# EAGLE design untitled (EAGLE 9.6.2)
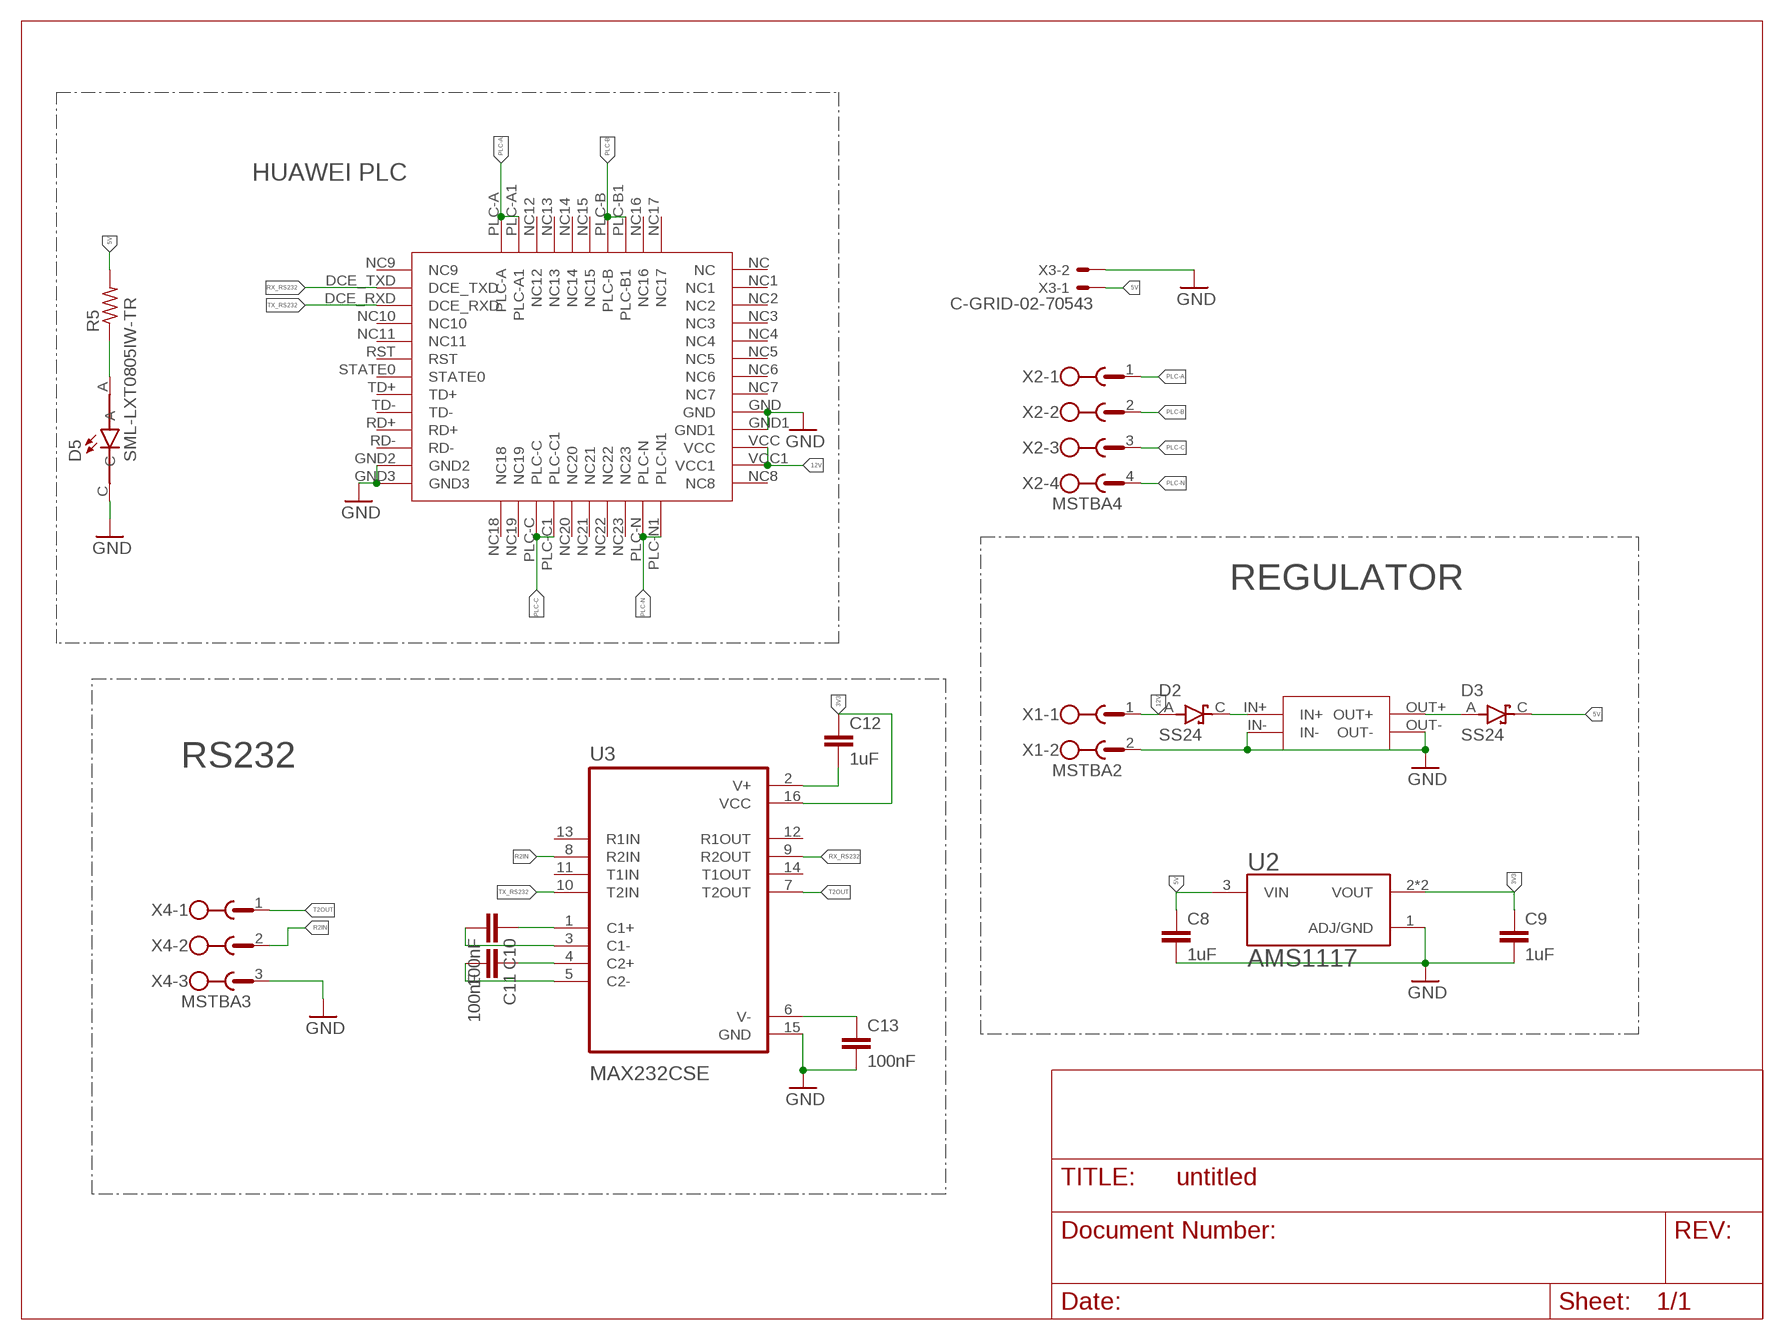
[diagram p0: schematic, sheet 1]

## Parts
C8  1uF  C-EUC0805K  [C0805K]
C9  1uF  C-EUC0805K  [C0805K]
C10  100nF  C-EUC0805K  [C0805K]
C11  100nF  C-EUC0805K  [C0805K]
C12  1uF  C-EUC0805K  [C0805K]
C13  100nF  C-EUC0805K  [C0805K]
D2  SS24  [DIOM5336X265N]
D3  SS24  [DIOM5336X265N]
D5  SML-LXT0805IW-TR  [LEDC2012X120N]
HUAWEI-PLC1  HUAWEI-PLC  [HUAWEI-PLC]
MINI1  MINI560  [MINI560]
R5  R-US_M0805  [M0805]
U2  AMS1117  [SOT229P700X180-4N]
U3  MAX232CSE  [SOIC127P600X175-16N]
X1  MSTBA2  [MSTBA2]
X2  MSTBA4  [MSTBA4]
X3  C-GRID-02-70543  [70543-02]
X4  MSTBA3  [MSTBA3]

## Nets
3V3: C9.1 C12.1 U2.2(VOUT) U2.4(VOUT) U3.16(VCC)
5V: C8.1 D3.C(K) R5.2 U2.3(VIN) X3.1
12V: D2.A HUAWEI-PLC1.VCC HUAWEI-PLC1.VCC1 X1.1
GND: C8.2 C9.2 C13.2 D5.C HUAWEI-PLC1.GND HUAWEI-PLC1.GND1 HUAWEI-PLC1.GND2 HUAWEI-PLC1.GND3 MINI1.IN- MINI1.OUT- U2.1(ADJ/GND) U3.15(GND) X1.2 X3.2 X4.3
N$7: D2.C(K) MINI1.IN+
N$9: D3.A MINI1.OUT+
N$11: C10.1 U3.1(C1+)
N$12: C10.2 U3.3(C1-)
N$13: C11.1 U3.4(C2+)
N$14: C11.2 U3.5(C2-)
N$15: C13.1 U3.6(V-)
N$17: C12.2 U3.2(V+)
N$19: D5.A R5.1
PLC-A: HUAWEI-PLC1.PLC-A HUAWEI-PLC1.PLC-A1 X2.1
PLC-B: HUAWEI-PLC1.PLC-B HUAWEI-PLC1.PLC-B1 X2.2
PLC-C: HUAWEI-PLC1.PLC-C HUAWEI-PLC1.PLC-C1 X2.3
PLC-N: HUAWEI-PLC1.PLC-N HUAWEI-PLC1.PLC-N1 X2.4
R2IN: U3.8(R2IN) X4.2
RX_RS232: HUAWEI-PLC1.DCE_TXD U3.9(R2OUT)
T2OUT: U3.7(T2OUT) X4.1
TX_RS232: HUAWEI-PLC1.DCE_RXD U3.10(T2IN)
Unconnected: HUAWEI-PLC1.NC HUAWEI-PLC1.NC1 HUAWEI-PLC1.NC2 HUAWEI-PLC1.NC3 HUAWEI-PLC1.NC4 HUAWEI-PLC1.NC5 HUAWEI-PLC1.NC6 HUAWEI-PLC1.NC7 HUAWEI-PLC1.NC8 HUAWEI-PLC1.NC9 HUAWEI-PLC1.NC10 HUAWEI-PLC1.NC11 HUAWEI-PLC1.NC12 HUAWEI-PLC1.NC13 HUAWEI-PLC1.NC14 HUAWEI-PLC1.NC15 HUAWEI-PLC1.NC16 HUAWEI-PLC1.NC17 HUAWEI-PLC1.NC18 HUAWEI-PLC1.NC19 HUAWEI-PLC1.NC20 HUAWEI-PLC1.NC21 HUAWEI-PLC1.NC22 HUAWEI-PLC1.NC23 HUAWEI-PLC1.RD+ HUAWEI-PLC1.RD- HUAWEI-PLC1.RST HUAWEI-PLC1.STATE0 HUAWEI-PLC1.TD+ HUAWEI-PLC1.TD- U3.11(T1IN) U3.12(R1OUT) U3.13(R1IN) U3.14(T1OUT)

## Notes on the sheet
- HUAWEI PLC
- REGULATOR
- RS232

## Library data of the parts
C8-C13 = rcl:C-EU: CAPACITOR, European symbol; SPICEPREFIX: C
D2 D3 = SS24:SS24: Diode Schottky 40V 2A Surface Mount DO-214AA (SMB) Check availability <https://pricing.snapeda.com/parts/SS24/ON%20Semiconductor/view-part?ref=eda>; AVAILABILITY: In Stock; CHECK_PRICES: https://www.snapeda.com/parts/SS24/Onsemi/view-part/?ref=eda; DESCRIPTION: Diode Schottky 40V 2A Surface Mount DO-214AA (SMB); MF: ON Semiconductor; MP: SS24; PACKAGE: DO-214AA ON Semiconductor; PRICE: None; SNAPEDA_LINK: https://www.snapeda.com/parts/SS24/Onsemi/view-part/?ref=snap
D5 = SML-LXT0805IW-TR:SML-LXT0805IW-TR: LED; Luminous Intensity:11µcd; Viewing Angle:140°; Forward Current:30mA; Forward Voltage:2V; Color:Red; LED Color:Red; Leaded Process Compatible:Yes; Lens Color:White; Mounting Type:Surface Mount ;RoHS Compliant: Yes Check availability <https://pricing.snapeda.com/parts/SML-LXT0805IW-TR/Lumex%20Opto/Components/view-part?ref=eda>; AVAILABILITY: In Stock; DESCRIPTION: Red - LED Indication - Discrete 2V 0805 (2012 Metric); MF: Lumex Opto/Components; MP: SML-LXT0805IW-TR; PACKAGE: 0805 Lumex; PRICE: None; PURCHASE-URL: https://pricing.snapeda.com/search/part/SML-LXT0805IW-TR/?ref=eda
HUAWEI-PLC1 = HUAWEI-PLC:HUAWEI-PLC
MINI1 = MINI560:MINI560
R5 = adafruit:R-US_: RESISTOR, American symbol
U2 = AMS1117:AMS1117: Sot223/Pkg 1-Amp 5-Volt Low Drop Out Voltage Regulatator Check availability <https://pricing.snapeda.com/parts/AMS1117/Advanced%20Monolithic%20Systems/view-part?ref=eda>; AVAILABILITY: Not in stock; DESCRIPTION: 1A LOW DROPOUT VOLTAGE REGULATOR SOT-223; MF: Advanced Monolithic Systems; MP: AMS1117; PACKAGE: SOT-223 Seeed Technology; PRICE: None
U3 = MAX232CSE:MAX232CSE: Check availability <https://pricing.snapeda.com/parts/MAX232CSE/Maxim%20Integrated/view-part?ref=eda>; AVAILABILITY: In Stock; DESCRIPTION: 2/2 Transceiver Full RS232 16-SOIC; MF: Maxim Integrated; MP: MAX232CSE; PACKAGE: SOIC-16 Maxim Integrated; PRICE: None; PURCHASE-URL: https://pricing.snapeda.com/search/part/MAX232CSE/?ref=eda
X1 = con-phoenix-508:MSTBA2: PHOENIX; MF: FARNELL; MPN: 1757242; OC_FARNELL: 3705171; OC_NEWARK: 71C4161
X2 = con-phoenix-508:MSTBA4: PHOENIX; MF: FARNELL; MPN: 1757268; OC_FARNELL: 3705195; OC_NEWARK: 71C4163
X3 = con-molex:C-GRID-02: CONNECTOR wire to board 2.54 mm (0.100") pitch header; MF: MOLEX; OC_FARNELL: unknown; OC_NEWARK: unknown
X4 = con-phoenix-508:MSTBA3: PHOENIX; MF: FARNELL; MPN: 1757255; OC_FARNELL: 3705183; OC_NEWARK: 71C4162

## Board
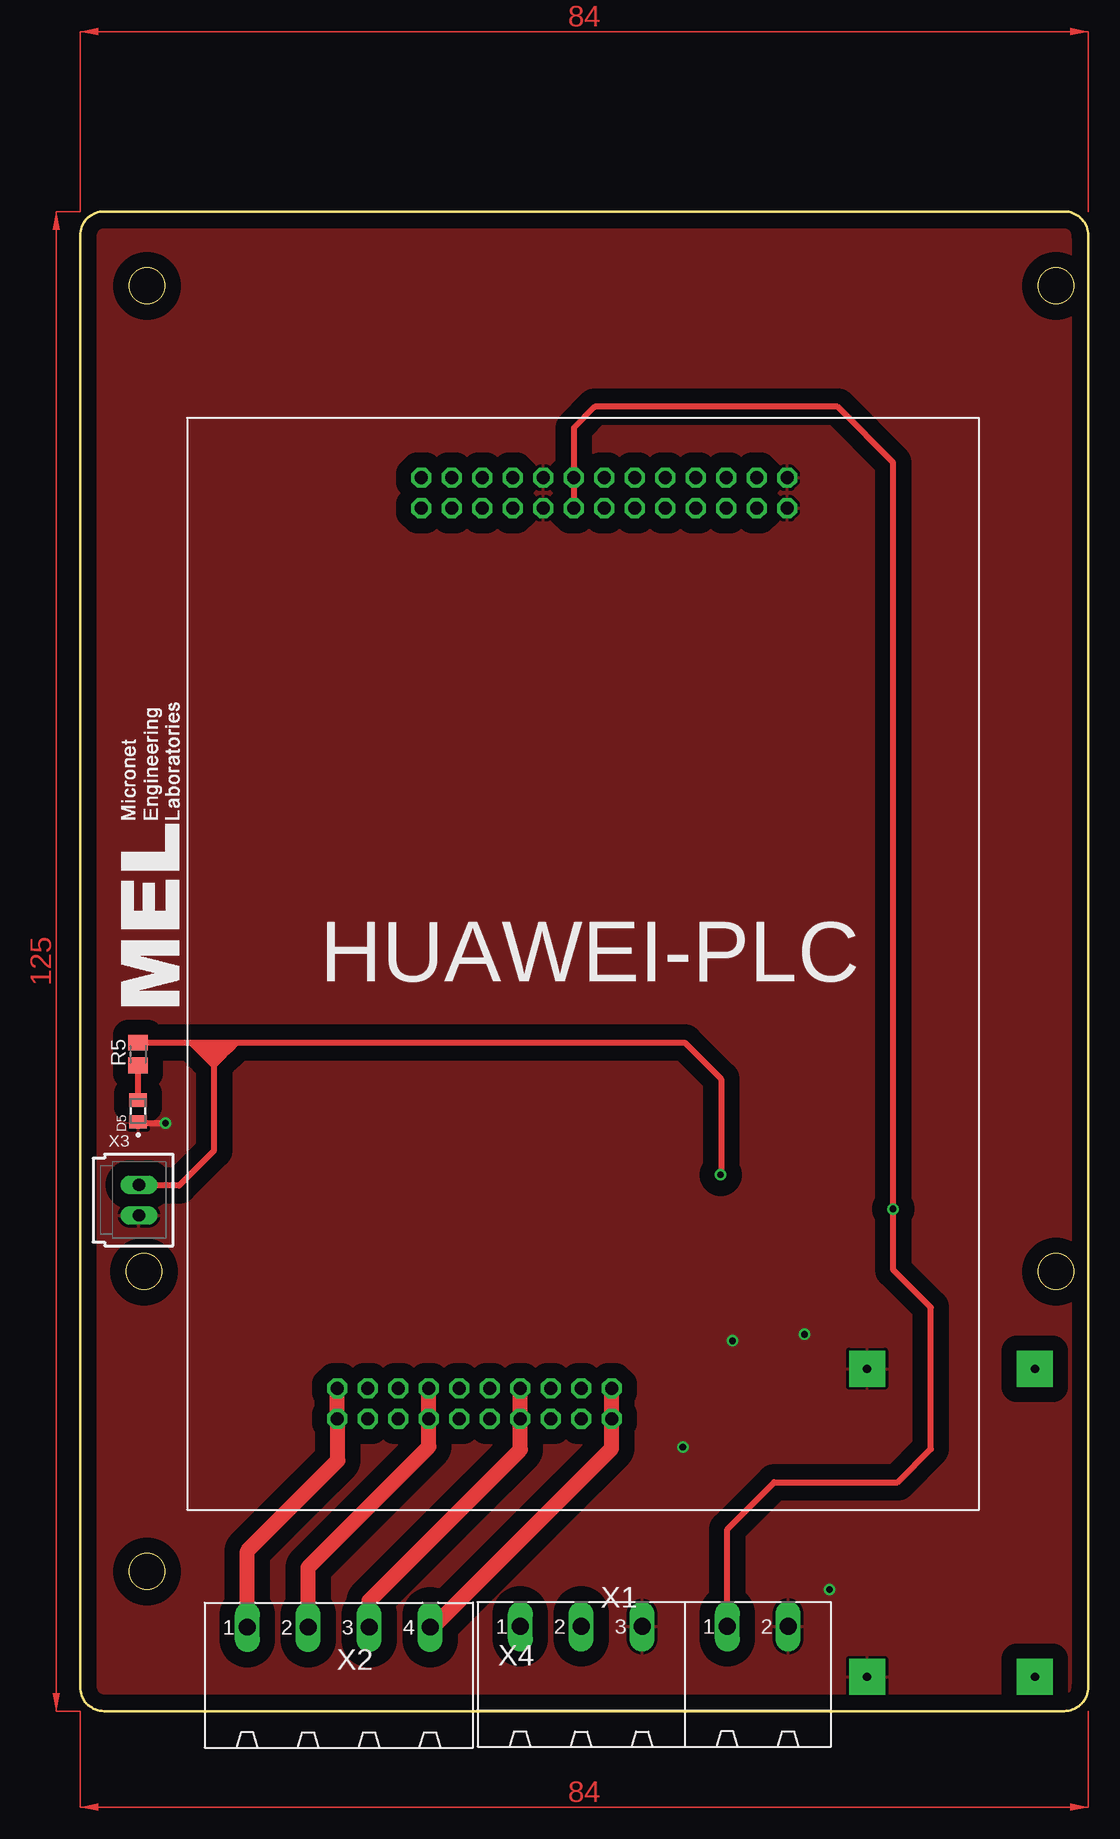
[diagram p1: board, top side]
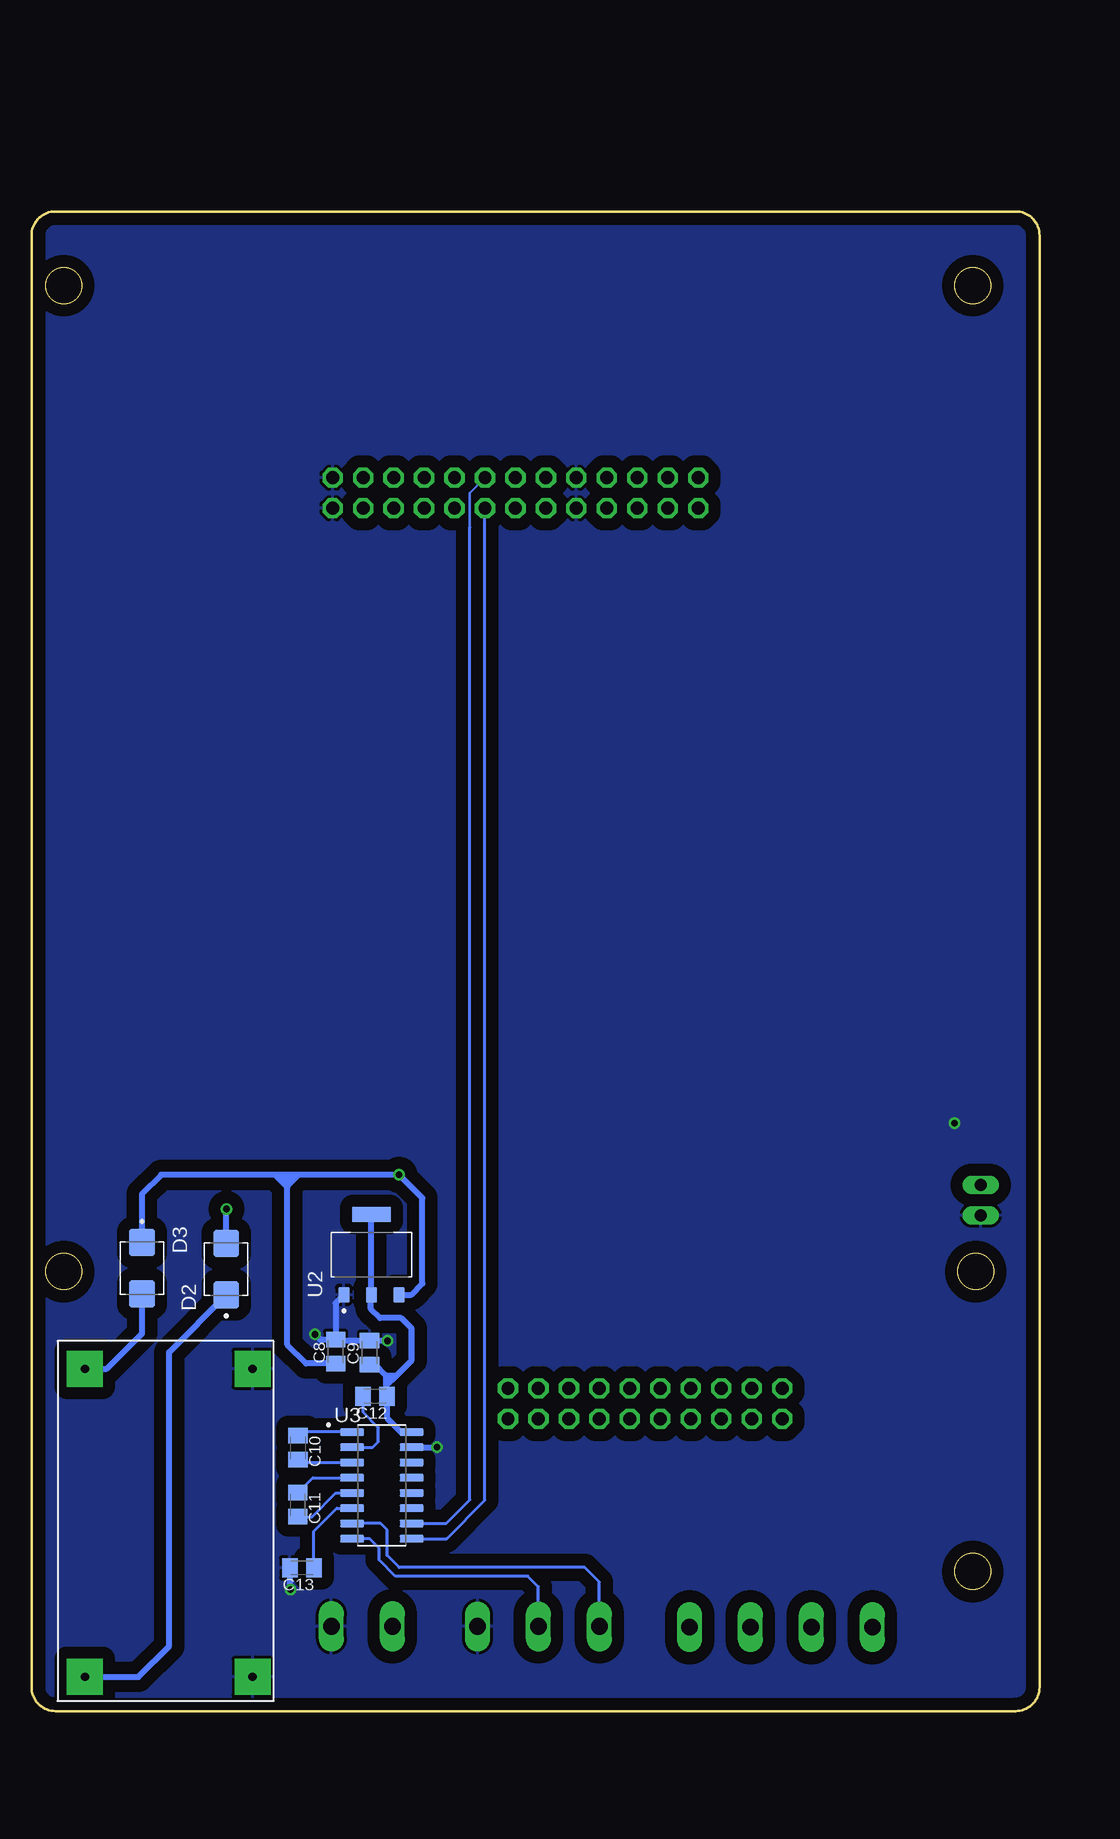
[diagram p2: board, bottom side, seen from below]

Size 84 x 125 mm. Coordinates in mm from the lower left corner, seen from the top.
Outline: 2,125 82,125 arc-90 84,123 84,2 arc-90 82,0 2,0 arc-90 0,2 0,123 arc-90 2,125
Outline: circle at 81.32,36.64 radius 1.5
Outline: circle at 81.32,118.81 radius 1.5
Outline: circle at 5.57,11.64 radius 1.5
Outline: circle at 5.57,118.81 radius 1.5
Outline: circle at 5.32,36.64 radius 1.5
Copper layers (1*16): Top 0.035mm / dielectric 1.5mm / Bottom 0.035mm
Design rules "default": minimum track width 6mil, minimum drill 0.35mm, track to track 6mil, track to pad 6mil, pad to pad 6mil, via to via 6mil, smd to smd 6mil, copper to edge 40mil, drill to drill 6mil, minimum pad ring 10mil, minimum via ring 8mil, stop-mask expansion 4mil, vias tented up to drill 0mil, thermal gap 10mil

### Footprints (pad centres in the part's own frame; a part is rotated, then mirrored left to right if it is on the bottom)
C0805K = smd 1.3 x 1.6: 1 -1,0; 2 1,0
DIOM5336X265N = smd 2.29 x 2.12: A 2.16,0; C -2.16,0
LEDC2012X120N = smd 1.1 x 1.45: A 0.9,0; C -0.9,0
HUAWEI-PLC = drill 1.08 pad 1.676 octagon: DCE_RXD -1.711,-4.975; DCE_TXD -1.711,-7.515; GND -9.331,-7.515; GND1 -9.331,-4.975; GND2 10.989,-7.515; GND3 10.989,-4.975; NC -19.491,-7.515; NC1 -19.491,-4.975; NC2 -16.951,-7.515; NC3 -16.951,-4.975; NC4 -14.411,-7.515; NC5 -14.411,-4.975; NC6 -11.871,-7.515; NC7 -11.871,-4.975; NC8 -4.251,-7.515; NC9 -4.251,-4.975; NC10 0.829,-7.515; NC11 0.829,-4.975; NC12 -23.948,-83.405; NC13 -23.948,-80.865; NC14 -21.408,-83.405; NC15 -21.408,-80.865; NC16 -16.328,-83.405; NC17 -16.328,-80.865; NC18 -13.788,-83.405; NC19 -13.788,-80.865; NC20 -8.708,-83.405; NC21 -8.708,-80.865; NC22 -6.168,-83.405; NC23 -6.168,-80.865; PLC-A -26.488,-83.405; PLC-A1 -26.488,-80.865; PLC-B -18.868,-83.405; PLC-B1 -18.868,-80.865; PLC-C -11.248,-83.405; PLC-C1 -11.248,-80.865; PLC-N -3.628,-83.405; PLC-N1 -3.628,-80.865; RD+ 8.449,-7.515; RD- 8.449,-4.975; RST 3.369,-7.515; STATE0 3.369,-4.975; TD+ 5.909,-7.515; TD- 5.909,-4.975; VCC -6.791,-7.515; VCC1 -6.791,-4.975
MINI560 = drill 0.7 pad 3 square: IN+ 0,-1.27; IN- 0,-15.24; OUT+ 25.67,-1.27; OUT- 25.67,-15.24
M0805 = smd 1.3 x 1.6: 1 -0.95,0; 2 0.95,0
SOT229P700X180-4N = smd 1.31 x 0.93: 1 -3.345,2.29; 2 -3.345,0; 3 -3.345,-2.29 | smd 1.31 x 3.24: 4 3.345,0
SOIC127P600X175-16N = smd 1.97 x 0.59: 1 -2.475,4.445; 2 -2.475,3.175; 3 -2.475,1.905; 4 -2.475,0.635; 5 -2.475,-0.635; 6 -2.475,-1.905; 7 -2.475,-3.175; 8 -2.475,-4.445; 9 2.475,-4.445; 10 2.475,-3.175; 11 2.475,-1.905; 12 2.475,-0.635; 13 2.475,0.635; 14 2.475,1.905; 15 2.475,3.175; 16 2.475,4.445
MSTBA2 = drill 1.397 long: 1 -2.54,5.08; 2 2.54,5.08
MSTBA4 = drill 1.397 long: 1 -7.62,5.08; 2 -2.54,5.08; 3 2.54,5.08; 4 7.62,5.08
70543-02 = drill 1.016 long: 1 -1.27,0; 2 1.27,0
MSTBA3 = drill 1.397 long: 1 -5.08,5.08; 2 0,5.08; 3 5.08,5.08

### Placement (x,y rotation side)
C8  58.66,29.97 90 bottom
C9  55.84,29.88 90 bottom
C10  61.79,21.96 270 bottom
C11  61.82,17.2 270 bottom
C12  55.38,26.24 180 bottom
C13  61.47,11.95 180 bottom
D2  67.78,36.84 90 bottom
D3  74.79,36.92 270 bottom
D5  4.84,50.02 90 top
HUAWEI-PLC1  47.93,107.78 0 top
MINI1  80.83,2.86 90 bottom
R5  4.82,54.77 90 top
U2  55.68,38.05 90 bottom
U3  54.81,18.82 0 bottom
X1  56.47,1.99 0 top
X2  21.55,1.92 0 top
X3  4.9,42.59 270 top
X4  41.76,1.98 0 top

### Tracks (layer width: path | path; a pad name or v marks a point on that pad's centre or on a via)
3V3
  Bottom 0.508: U3.16 53.22,23.26 54.36,24.4 54.36,26.23 C12.1 54.48,26.35 54.48,27.1 | C9.1 55.37,28.89 54.48,28 | 54.48,28 54.48,27.1 | U2.4 U2.2 55.72,34.67 55.72,33.52 54.95,32.76 53.21,32.76 52.33,31.88 52.33,29.25 53.59,28 | 54.48,28 53.59,28 | 53.59,28 53.59,27.99 54.48,27.1
5V  (via drill 0.55)
  Top 0.508: R5.2 9.24,55.72 | 11.17,53.78 10.56,54.39 | 10.15,54.8 9.24,55.72 | 11.17,53.78 11.17,46.74 8.24,43.81 4.96,43.81 X3.1 | 9.24,55.72 10.15,55.72 | 10.15,55.72 10.63,55.72 | 10.63,55.72 11,55.72 | 11,55.72 11.48,55.72 | 11.48,55.72 11.84,55.72 | 11.84,55.72 12.3,55.72 | 12.3,55.72 13.04,55.72 | 13.04,55.72 50.37,55.72 53.41,52.68 53.41,44.62 53.37,44.66 v53.37,44.7 | 11.17,53.78 11.17,53.85 11.27,53.95 | 11.27,53.95 11.61,54.29 | 11.61,54.29 11.99,54.66 | 11.99,54.66 12.45,55.12 | 12.45,55.12 13.04,55.72 | 10.56,54.39 10.15,54.8 | 10.15,54.8 10.15,55.72 | 10.56,54.39 10.56,55.65 10.63,55.72 | 11.27,53.95 11,54.22 11,55.72 | 11.61,54.29 11.48,54.42 11.48,55.72 | 11.99,54.66 11.99,55.57 11.84,55.72 | 12.45,55.12 12.45,55.57 12.3,55.72
  Bottom 0.508: U2.3 52.35,34.71 51.43,35.63 51.43,42.76 v53.37,44.7 61.77,44.7 | 61.77,44.7 63.69,44.7 | 63.69,44.7 73.19,44.7 74.8,43.09 74.8,39.09 D3.C | C8.1 61.11,28.97 62.68,30.54 62.68,43.68 | 62.68,43.68 63.16,44.17 | 63.16,44.17 63.69,44.7 | 62.68,43.68 62.68,43.79 62.2,44.28 | 62.2,44.28 61.77,44.7 | 62.2,44.28 63.06,44.28 63.16,44.17
12V  (via drill 0.55)
  Top 0.508: HUAWEI-PLC1.VCC HUAWEI-PLC1.VCC1 41.13,106.96 42.89,108.72 63.12,108.72 67.75,104.08 67.75,42.17 v67.75,41.86 67.75,36.78 70.89,33.64 70.89,21.84 68.12,19.07 57.84,19.07 53.93,15.16 X1.1
  Bottom 0.508: D2.A 67.78,41.87 67.77,41.88 v67.75,41.86
GND  (via drill 0.55)
  Top 0.508: D5.C 4.93,49.02 v7.1,49.02
  Bottom 0.508: C8.2 58.57,30.89 C9.2 54.37,30.89 v54.35,30.86 | U2.1 58.66,34.02 C8.2 | U3.15 v50.22,21.99 | C13.2 62.47,10.16 v62.44,10.13 | v60.38,31.4 59.95,30.97 C8.2
  pour Top (isolate 1.27): 0,125 84,125 84,0 0,0
  pour Bottom (isolate 1.016): 0,125 84,125 84,0 0,0
N$7
  Bottom 0.508: MINI1.IN+ 75.1,2.86 72.55,5.41 72.55,29.91 D2.C
N$9
  Bottom 0.508: MINI1.OUT+ 77.75,28.53 74.79,31.48 D3.A
N$11
  Bottom 0.254: U3.1 61.49,23.26 C10.1
N$12
  Bottom 0.254: C10.2 61.55,20.72 U3.3
N$13
  Bottom 0.254: C11.1 60.57,19.45 U3.4
N$14
  Bottom 0.254: C11.2 60.62,16.2 58.64,18.18 U3.5
N$15
  Bottom 0.254: C13.1 60.47,15 58.56,16.91 U3.6
N$17
  Bottom 0.254: U3.2 55.56,21.99 55.1,22.45 55.1,23.63 56.38,24.9 C12.2
N$19
  Top 0.508: D5.A 4.82,50.93 R5.1
PLC-A
  Top 1.27: X2.1 13.93,13.35 21.48,20.9 21.48,24.34 HUAWEI-PLC1.PLC-A HUAWEI-PLC1.PLC-A1
PLC-B
  Top 1.27: X2.2 19.01,11.98 29.06,22.03 HUAWEI-PLC1.PLC-B HUAWEI-PLC1.PLC-B1
PLC-C
  Top 1.27: X2.3 24.09,9.2 36.68,21.79 HUAWEI-PLC1.PLC-C HUAWEI-PLC1.PLC-C1
PLC-N
  Top 1.27: X2.4 29.4,7 44.3,21.89 HUAWEI-PLC1.PLC-N HUAWEI-PLC1.PLC-N1
R2IN
  Bottom 0.254: X4.2 41.76,10.36 42.63,11.23 53.68,11.23 55.03,12.59 55.03,13.57 55.83,14.37 U3.8
RX_RS232
  Bottom 0.254: U3.9 49.41,14.37 46.22,17.57 HUAWEI-PLC1.DCE_TXD
T2OUT
  Bottom 0.254: X4.1 36.68,10.76 37.9,11.98 53.36,11.98 54.36,12.98 54.36,15.1 54.91,15.65 U3.7
TX_RS232
  Bottom 0.203: 47.48,98.68 47.48,101.54 HUAWEI-PLC1.DCE_RXD
  Bottom 0.254: U3.10 49.46,15.64 47.48,17.62 47.48,98.68
(copper drawn outside any net)
  shapes: Top area x3